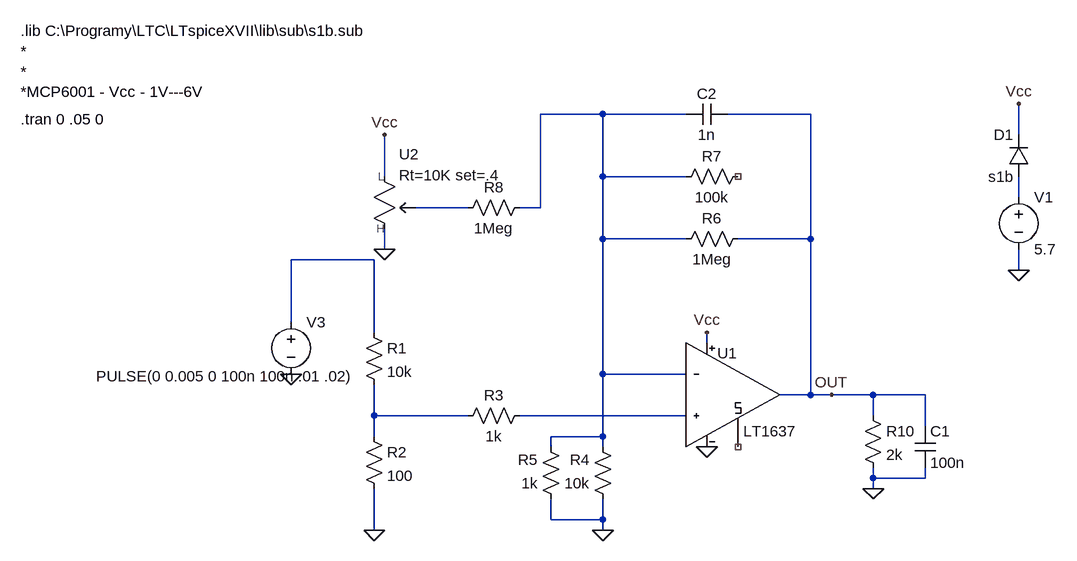
[diagram p0: schematic 7_op_amp.asc]
7_op_amp.asc, the LTspice schematic file:
Version 4
SHEET 1 1180 680
WIRE -16 -176 -112 -176
WIRE 112 -176 -16 -176
WIRE 304 -176 176 -176
WIRE 624 -144 624 -192
WIRE -352 -80 -352 -144
WIRE -16 -80 -16 -176
WIRE 112 -80 -16 -80
WIRE 624 -48 624 -80
WIRE -224 -32 -304 -32
WIRE -112 -32 -112 -176
WIRE -112 -32 -144 -32
WIRE -16 16 -16 -80
WIRE 112 16 -16 16
WIRE 304 16 304 -176
WIRE 304 16 192 16
WIRE -352 32 -352 0
WIRE -368 48 -496 48
WIRE 624 64 624 32
WIRE -496 144 -496 48
WIRE -368 160 -368 48
WIRE 144 176 144 160
WIRE -16 224 -16 16
WIRE 112 224 -16 224
WIRE 304 256 304 16
WIRE 304 256 256 256
WIRE 336 256 304 256
WIRE 400 256 336 256
WIRE 480 256 400 256
WIRE -368 288 -368 240
WIRE -224 288 -368 288
WIRE 112 288 -144 288
WIRE 400 288 400 256
WIRE 480 304 480 256
WIRE -368 320 -368 288
WIRE -16 320 -16 224
WIRE -16 320 -96 320
WIRE -96 336 -96 320
WIRE -16 336 -16 320
WIRE 400 384 400 368
WIRE 480 384 480 368
WIRE 480 384 400 384
WIRE 400 400 400 384
WIRE -96 448 -96 416
WIRE -16 448 -16 416
WIRE -16 448 -96 448
WIRE -368 464 -368 400
WIRE -16 464 -16 448
FLAG 624 64 0
FLAG 624 -192 Vcc
FLAG 144 160 Vcc
FLAG -496 224 0
FLAG 336 256 OUT
FLAG 400 400 0
FLAG 144 336 0
FLAG -368 464 0
FLAG -16 464 0
FLAG -352 32 0
FLAG -352 -144 Vcc
SYMBOL voltage 624 -64 R0
WINDOW 123 0 0 Left 2
WINDOW 39 0 0 Left 2
SYMATTR InstName V1
SYMATTR Value 5.7
SYMBOL voltage -496 128 R0
WINDOW 123 0 0 Left 2
WINDOW 39 0 0 Left 2
WINDOW 3 -300 99 Left 2
SYMATTR Value PULSE(0 0.005 0 100n 100n .01 .02)
SYMATTR InstName V3
SYMBOL res 384 272 R0
SYMATTR InstName R10
SYMATTR Value 2k
SYMBOL cap 464 304 R0
SYMATTR InstName C1
SYMATTR Value 100n
SYMBOL Opamps\\LT1637 144 256 R0
SYMATTR InstName U1
SYMBOL res -384 144 R0
SYMATTR InstName R1
SYMATTR Value 10k
SYMATTR SpiceLine tol=1
SYMBOL res -384 304 R0
SYMATTR InstName R2
SYMATTR Value 100
SYMATTR SpiceLine tol=1
SYMBOL res -128 272 R90
WINDOW 0 0 56 VBottom 2
WINDOW 3 32 56 VTop 2
SYMATTR InstName R3
SYMATTR Value 1k
SYMATTR SpiceLine tol=1
SYMBOL res 0 432 R180
WINDOW 0 36 76 Left 2
WINDOW 3 36 40 Left 2
SYMATTR InstName R4
SYMATTR Value 10k
SYMATTR SpiceLine tol=1
SYMBOL res -80 432 R180
WINDOW 0 36 76 Left 2
WINDOW 3 36 40 Left 2
SYMATTR InstName R5
SYMATTR Value 1k
SYMATTR SpiceLine tol=1
SYMBOL res 208 0 R90
WINDOW 0 0 56 VBottom 2
WINDOW 3 32 56 VTop 2
SYMATTR InstName R6
SYMATTR Value 1Meg
SYMATTR SpiceLine tol=1
SYMBOL res 208 -96 R90
WINDOW 0 0 56 VBottom 2
WINDOW 3 32 56 VTop 2
SYMATTR InstName R7
SYMATTR Value 100k
SYMATTR SpiceLine tol=1
SYMBOL cap 176 -192 R90
WINDOW 0 0 32 VBottom 2
WINDOW 3 32 32 VTop 2
SYMATTR InstName C2
SYMATTR Value 1n
SYMATTR SpiceLine V=25
SYMBOL res -128 -48 R90
WINDOW 0 0 56 VBottom 2
WINDOW 3 32 56 VTop 2
SYMATTR InstName R8
SYMATTR Value 1Meg
SYMATTR SpiceLine tol=1
SYMBOL Pot&Sw\\potentiometer -368 -96 R0
WINDOW 0 38 -18 Left 2
WINDOW 3 38 14 Left 2
SYMATTR InstName U2
SYMATTR Value Rt=10K set=.4
SYMBOL diode 640 -80 R180
WINDOW 0 24 64 Left 2
WINDOW 3 24 0 Left 2
SYMATTR InstName D1
SYMATTR Value s1b
TEXT -912 -304 Left 2 !.lib C:\\Programy\\LTC\\LTspiceXVII\\lib\\sub\\s1b.sub\n*\n*\n*MCP6001 - Vcc - 1V---6V
TEXT -912 -168 Left 2 !.tran 0 .05 0

The netlist it stands for:
* 7_op_amp.asc
V1 N002 0 5.7
V3 N004 0 PULSE(0 0.005 0 100n 100n .01 .02)
R10 OUT 0 2k
C1 OUT 0 100n
XU1 N006 N001 Vcc 0 OUT NC_01 LT1637  ; pins In+ In- V+ V- OUT SHDN
R1 N004 N005 10k tol=1
R2 N005 0 100 tol=1
R3 N006 N005 1k tol=1
R4 0 N001 10k tol=1
R5 0 N001 1k tol=1
R6 OUT N001 1Meg tol=1
R7 NC_02 N001 100k tol=1
C2 OUT N001 1n V=25
R8 N001 N003 1Meg tol=1
XU2 0 Vcc N003 potentiometer Rt=10K set=.4  ; pins H L 3
D1 N002 Vcc s1b
.model D D
.lib standard.dio
.lib C:\Programy\LTC\LTspiceXVII\lib\sub\s1b.sub
*
*
*MCP6001 - Vcc - 1V---6V
.tran 0 .05 0
.lib LTC.lib
.lib pote.lib
.backanno
.end